# EAGLE schematic DAPlink_STM32F103-v1.0.0 (EAGLE 7.7.0)
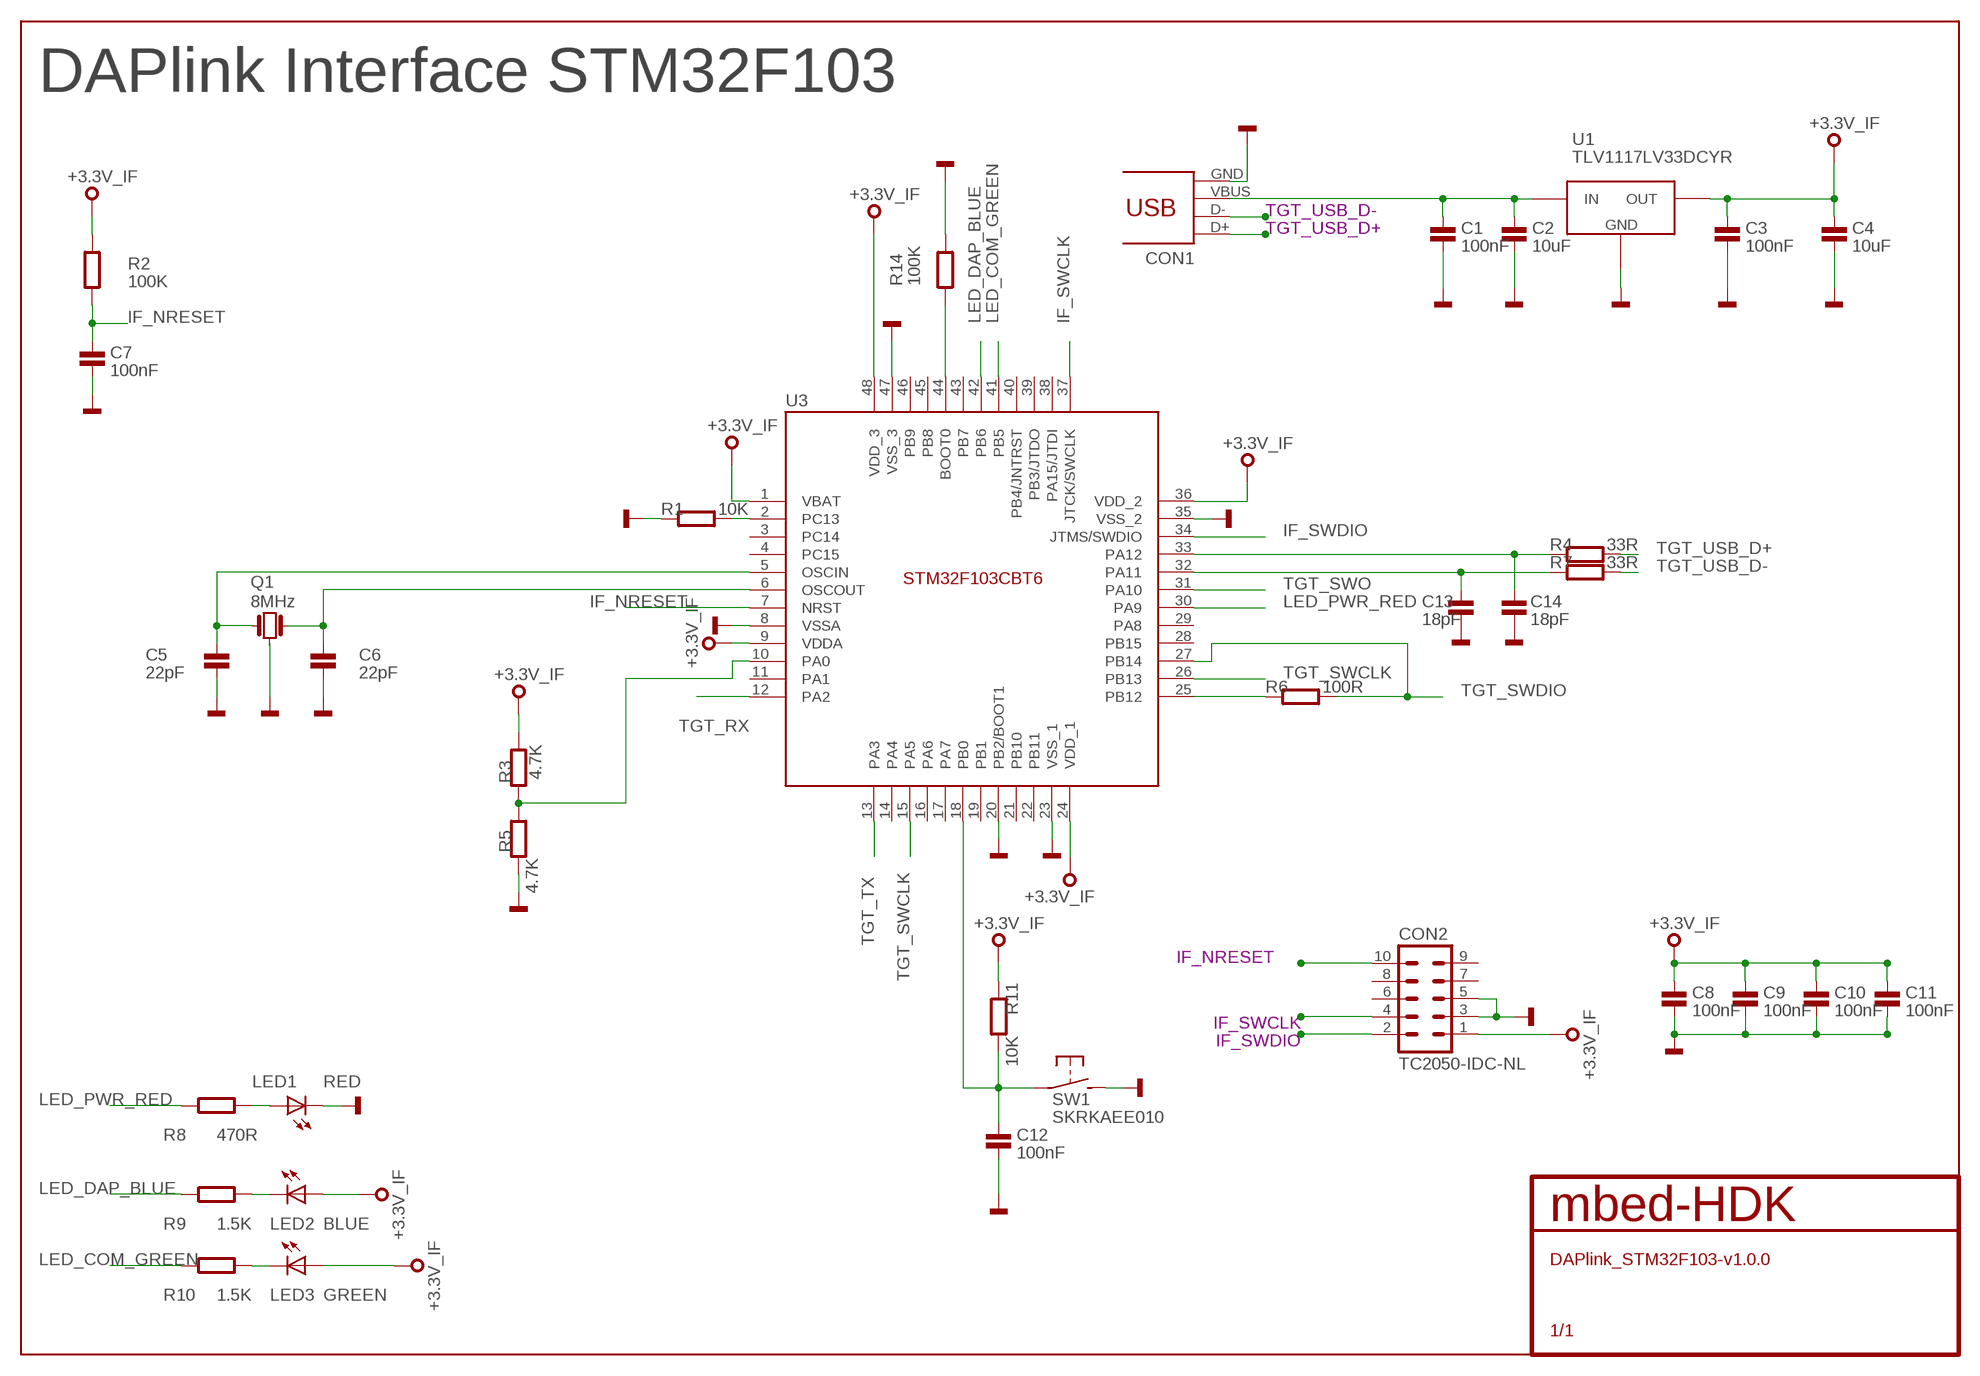
[diagram p0: schematic, sheet 1]

## Parts
C1  100nF  CAPACITOR0402  [0402]
C2  10uF  CAPACITOR0603  [0603]
C3  100nF  CAPACITOR0402  [0402]
C4  10uF  CAPACITOR0603  [0603]
C5  22pF  CAPACITOR0402  [0402]
C6  22pF  CAPACITOR0402  [0402]
C7  100nF  CAPACITOR0402  [0402]
C8  100nF  CAPACITOR0402  [0402]
C9  100nF  CAPACITOR0402  [0402]
C10  100nF  CAPACITOR0402  [0402]
C11  100nF  CAPACITOR0402  [0402]
C12  100nF  CAPACITOR0402  [0402]
C13  18pF  CAPACITOR0402  [0402]
C14  18pF  CAPACITOR0402  [0402]
CON1  47346-0001  [USB-MICRO-B-H]
CON2  TC2050-IDC-NL  [TC2050-IDC-NL]
LED1  RED  LED0603  [CHIPLED_0603]
LED2  BLUE  LED0603  [CHIPLED_0603]
LED3  GREEN  LED0603  [CHIPLED_0603]
Q1  8MHz  CSTCE8M00G55-R0  [CSTCE8M00G55-R0]
R1  10K  RESISTOR0402  [0402]
R2  100K  RESISTOR0402  [0402]
R3  4.7K  RESISTOR0402  [0402]
R4  33R  RESISTOR0402  [0402]
R5  4.7K  RESISTOR0402  [0402]
R6  100R  RESISTOR0402  [0402]
R7  33R  RESISTOR0402  [0402]
R8  470R  RESISTOR0402  [0402]
R9  1.5K  RESISTOR0402  [0402]
R10  1.5K  RESISTOR0402  [0402]
R11  10K  RESISTOR0402  [0402]
R14  100K  RESISTOR0402  [0402]
SW1  SKRKAEE010  [SKRKAEE010]
U1  TLV1117LV33DCYR  [SOT223]
U3  STM32F103CBT6  [LQFP48]

## Nets
+3.3V_IF: C3.1 C4.1 C8.1 C9.1 C10.1 C11.1 CON2.1 LED2.A LED3.A R2.1 R3.1 R11.1 U1.2(OUT) U1.4(OUT) U3.1(VBAT) U3.9(VDDA) U3.24(VDD_1) U3.36(VDD_2) U3.48(VDD_3)
GND: C1.2 C2.2 C3.2 C4.2 C5.2 C6.2 C7.2 C8.2 C9.2 C10.2 C11.2 C12.2 C13.2 C14.2 CON1.GND CON2.3 CON2.5 LED1.C Q1.2 R1.1 R5.2 R14.1 SW1.P$2(S) U1.1(GND) U3.8(VSSA) U3.20(PB2/BOOT1) U3.23(VSS_1) U3.35(VSS_2) U3.47(VSS_3)
IF_NRESET: C7.1 CON2.10 R2.2 U3.7(NRST)
IF_SWCLK: CON2.4 U3.37(JTCK/SWCLK)
IF_SWDIO: CON2.2 U3.34(JTMS/SWDIO)
LED_COM_GREEN: R10.2 U3.41(PB5)
LED_DAP_BLUE: R9.2 U3.42(PB6)
LED_PWR_RED: R8.2 U3.30(PA9)
N$1: C1.1 C2.1 CON1.VBUS U1.3(IN)
N$2: LED1.A R8.1
N$3: R14.2 U3.44(BOOT0)
N$4: R1.2 U3.2(PC13)
N$5: C5.1 Q1.1 U3.5(OSCIN)
N$6: C6.1 Q1.3 U3.6(OSCOUT)
N$8: R3.2 R5.1 U3.10(PA0)
N$12: R6.1 U3.25(PB12)
N$13: LED2.C R9.1
N$14: LED3.C R10.1
N$15: C14.1 R4.1 U3.33(PA12)
N$17: C13.1 R7.1 U3.32(PA11)
TGT_NRESET: C12.1 R11.2 SW1.P$1(P) U3.18(PB0)
TGT_RX: U3.12(PA2)
TGT_SWCLK: U3.15(PA5) U3.26(PB13)
TGT_SWDIO: R6.2 U3.27(PB14)
TGT_SWO: U3.31(PA10)
TGT_TX: U3.13(PA3)
TGT_USB_D+: CON1.D+ R4.2
TGT_USB_D-: CON1.D- R7.2
Unconnected: CON2.6 CON2.7 CON2.8 CON2.9 U3.3(PC14) U3.4(PC15) U3.11(PA1) U3.14(PA4) U3.16(PA6) U3.17(PA7) U3.19(PB1) U3.21(PB10) U3.22(PB11) U3.28(PB15) U3.29(PA8) U3.38(PA15/JTDI) U3.39(PB3/JTDO) U3.40(PB4/JNTRST) U3.43(PB7) U3.45(PB8) U3.46(PB9)

## Notes on the sheet
- DAPlink Interface STM32F103

## Library data of the parts
C1 C3 C7-C12 = mbed-HDK-RLCQ:CAPACITOR: Capacitor
C2 C4-C6 C13 C14 = mbed-HDK-RLC:CAPACITOR: Capacitor
CON1 = mbed-HDK-Connector:47346-0001: USB Receptacle Horizontal Micro Type B; MF: MOLEX; MFN: 47346-0001; OC-MOUSER: 538-47346-0001; OC-NEWARK: 1568026
CON2 = mbed-HDK-Connector:TC2050-IDC: Tag-Connect In Circuit Programming & Debug Cable 10 Pin
LED1-LED3 = mbed-HDK-Optical:LED: LED SMD
Q1 = mbed-HDK-Oscillator:CSTCE8M00G55-R0: Resonator Cermanic, Murata 8MHz 33pF; MF: Murata; MFN: CSTCE8M00G55-R0; OC-DIGIKEY: 490-1195-1-ND; OC-MOUSER: 81-CSTCE8M00G55-R0; OC-NEWARK: 2443270
R1 R4 R6 R7 = mbed-HDK-RLC:RESISTOR: Resistor
R2 R3 R5 R8-R11 R14 = mbed-HDK-RLCQ:RESISTOR: Resistor
SW1 = mbed-HDK-Switch:SKRKAEE010: MOMENTARY SWITCH PUSH VERTICAL (SPST); MF: ALPS; MFN: SKRKAEE010; OC-MOUSER: 688-SKRKAE
U1 = mbed-HDK-Power:TLV1117LV33DCYR: LDO Fixed Regulator 3.3v, 1A; MF: Texas Instruments; MFN: TLV1117LV33DCYR; OC-DIGIKEY: 296-28778-1-ND; OC-MOUSER: 595-TLV1117LV33DCYR; OC-NEWARK: 2323647
U3 = mbed-HDK-MF-ST:STM32F103CBT6: ARM® Cortex®-M3 STM32 F1 Microcontroller IC 32-Bit 72MHz 128KB (128K x 8) FLASH; MF: STMicroelectronics; MFN: STM32F103CBT6; OC-DIGIKEY: 497-6288-ND; OC-MOUSER: 511-STM32F103CBT6; OC-NEWARK: 11N8296